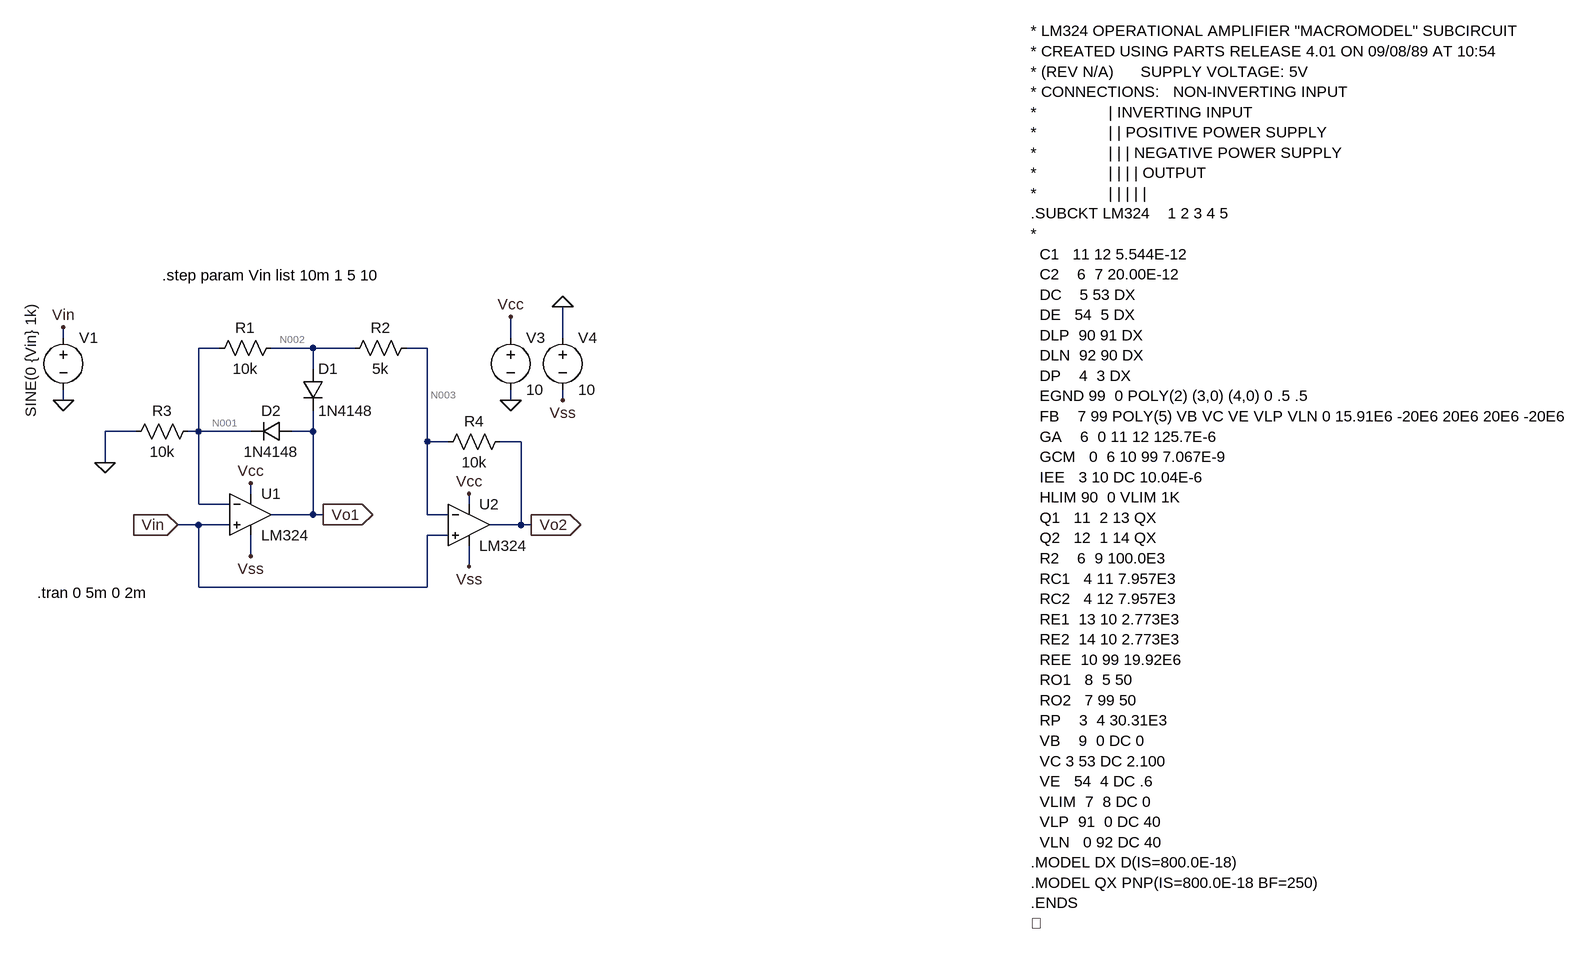
[diagram p0: schematic L1_C3.asc]
L1_C3.asc, the LTspice schematic file:
Version 4
SHEET 1 2516 10852
WIRE -144 -80 -144 -96
WIRE 544 -80 544 -112
WIRE 624 -80 624 -128
WIRE 96 -64 64 -64
WIRE 240 -64 176 -64
WIRE 304 -64 240 -64
WIRE 416 -64 384 -64
WIRE 240 -32 240 -64
WIRE -144 16 -144 0
WIRE 544 16 544 0
WIRE 624 16 624 0
WIRE -32 64 -80 64
WIRE 64 64 64 -64
WIRE 64 64 48 64
WIRE 144 64 64 64
WIRE 240 64 240 32
WIRE 240 64 208 64
WIRE 416 80 416 -64
WIRE 448 80 416 80
WIRE 560 80 528 80
WIRE -80 112 -80 64
WIRE 144 160 144 144
WIRE 64 176 64 64
WIRE 112 176 64 176
WIRE 480 176 480 160
WIRE 240 192 240 64
WIRE 240 192 176 192
WIRE 256 192 240 192
WIRE 416 192 416 80
WIRE 448 192 416 192
WIRE 64 208 32 208
WIRE 112 208 64 208
WIRE 560 208 560 80
WIRE 560 208 512 208
WIRE 576 208 560 208
WIRE 448 224 416 224
WIRE 144 256 144 224
WIRE 480 272 480 240
WIRE 64 304 64 208
WIRE 416 304 416 224
WIRE 416 304 64 304
FLAG -144 16 0
FLAG 544 16 0
FLAG 32 208 Vin
IOPIN 32 208 In
FLAG -144 -96 Vin
FLAG 624 -128 0
FLAG 544 -112 Vcc
FLAG 144 144 Vcc
FLAG 480 160 Vcc
FLAG 624 16 Vss
FLAG 480 272 Vss
FLAG 144 256 Vss
FLAG 576 208 Vo2
IOPIN 576 208 Out
FLAG -80 112 0
FLAG 256 192 Vo1
IOPIN 256 192 Out
SYMBOL res 192 -80 R90
WINDOW 0 0 56 VBottom 2
WINDOW 3 32 56 VTop 2
SYMATTR InstName R1
SYMATTR Value 10k
SYMBOL res 400 -80 R90
WINDOW 0 0 56 VBottom 2
WINDOW 3 32 56 VTop 2
SYMATTR InstName R2
SYMATTR Value 5k
SYMBOL res 64 48 R90
WINDOW 0 0 56 VBottom 2
WINDOW 3 32 56 VTop 2
SYMATTR InstName R3
SYMATTR Value 10k
SYMBOL res 544 64 R90
WINDOW 0 0 56 VBottom 2
WINDOW 3 32 56 VTop 2
SYMATTR InstName R4
SYMATTR Value 10k
SYMBOL voltage -144 -96 R0
WINDOW 123 0 0 Left 0
WINDOW 39 0 0 Left 0
WINDOW 3 -50 -37 VRight 2
SYMATTR Value SINE(0 {Vin} 1k)
SYMATTR InstName V1
SYMBOL voltage 544 -96 R0
WINDOW 123 0 0 Left 0
WINDOW 39 0 0 Left 0
SYMATTR InstName V3
SYMATTR Value 10
SYMBOL voltage 624 -96 R0
WINDOW 123 0 0 Left 0
WINDOW 39 0 0 Left 0
SYMATTR InstName V4
SYMATTR Value 10
SYMBOL diode 208 48 R90
WINDOW 0 0 32 VBottom 2
WINDOW 3 32 32 VTop 2
SYMATTR InstName D2
SYMATTR Value 1N4148
SYMBOL diode 224 -32 R0
SYMATTR InstName D1
SYMATTR Value 1N4148
SYMBOL OpAmps\\opamp2 144 128 R0
SYMATTR InstName U1
SYMATTR Value LM324
SYMBOL OpAmps\\opamp2 480 144 R0
SYMATTR InstName U2
SYMATTR Value LM324
TEXT -184 312 Left 2 !.tran 0 5m 0 2m
TEXT 8 -176 Left 2 !.step param Vin list 10m 1 5 10
TEXT 1344 -552 Left 2 !* LM324 OPERATIONAL AMPLIFIER "MACROMODEL" SUBCIRCUIT\n* CREATED USING PARTS RELEASE 4.01 ON 09/08/89 AT 10:54\n* (REV N/A)      SUPPLY VOLTAGE: 5V\n* CONNECTIONS:   NON-INVERTING INPUT\n*                | INVERTING INPUT\n*                | | POSITIVE POWER SUPPLY\n*                | | | NEGATIVE POWER SUPPLY\n*                | | | | OUTPUT\n*                | | | | |\n.SUBCKT LM324    1 2 3 4 5\n*\n  C1   11 12 5.544E-12\n  C2    6  7 20.00E-12\n  DC    5 53 DX\n  DE   54  5 DX\n  DLP  90 91 DX\n  DLN  92 90 DX\n  DP    4  3 DX\n  EGND 99  0 POLY(2) (3,0) (4,0) 0 .5 .5\n  FB    7 99 POLY(5) VB VC VE VLP VLN 0 15.91E6 -20E6 20E6 20E6 -20E6\n  GA    6  0 11 12 125.7E-6\n  GCM   0  6 10 99 7.067E-9\n  IEE   3 10 DC 10.04E-6\n  HLIM 90  0 VLIM 1K\n  Q1   11  2 13 QX\n  Q2   12  1 14 QX\n  R2    6  9 100.0E3\n  RC1   4 11 7.957E3\n  RC2   4 12 7.957E3\n  RE1  13 10 2.773E3\n  RE2  14 10 2.773E3\n  REE  10 99 19.92E6\n  RO1   8  5 50\n  RO2   7 99 50\n  RP    3  4 30.31E3\n  VB    9  0 DC 0\n  VC 3 53 DC 2.100\n  VE   54  4 DC .6\n  VLIM  7  8 DC 0\n  VLP  91  0 DC 40\n  VLN   0 92 DC 40\n.MODEL DX D(IS=800.0E-18)\n.MODEL QX PNP(IS=800.0E-18 BF=250)\n.ENDS\n

The netlist it stands for:
* L1_C3.asc
R1 N002 N001 10k
R2 N003 N002 5k
R3 N001 0 10k
R4 Vo2 N003 10k
V1 Vin 0 SINE(0 {Vin} 1k)
V3 Vcc 0 10
V4 0 Vss 10
D2 Vo1 N001 1N4148
D1 N002 Vo1 1N4148
XU1 Vin N001 Vcc Vss Vo1 LM324  ; pins In+ In- V+ V- OUT
XU2 Vin N003 Vcc Vss Vo2 LM324  ; pins In+ In- V+ V- OUT
.model D D
.lib standard.dio
.tran 0 5m 0 2m
.step param Vin list 10m 1 5 10
* LM324 OPERATIONAL AMPLIFIER "MACROMODEL" SUBCIRCUIT
* CREATED USING PARTS RELEASE 4.01 ON 09/08/89 AT 10:54
* (REV N/A)      SUPPLY VOLTAGE: 5V
* CONNECTIONS:   NON-INVERTING INPUT
*                | INVERTING INPUT
*                | | POSITIVE POWER SUPPLY
*                | | | NEGATIVE POWER SUPPLY
*                | | | | OUTPUT
*                | | | | |
.SUBCKT LM324    1 2 3 4 5
*
  C1   11 12 5.544E-12
  C2    6  7 20.00E-12
  DC    5 53 DX
  DE   54  5 DX
  DLP  90 91 DX
  DLN  92 90 DX
  DP    4  3 DX
  EGND 99  0 POLY(2) (3,0) (4,0) 0 .5 .5
  FB    7 99 POLY(5) VB VC VE VLP VLN 0 15.91E6 -20E6 20E6 20E6 -20E6
  GA    6  0 11 12 125.7E-6
  GCM   0  6 10 99 7.067E-9
  IEE   3 10 DC 10.04E-6
  HLIM 90  0 VLIM 1K
  Q1   11  2 13 QX
  Q2   12  1 14 QX
  R2    6  9 100.0E3
  RC1   4 11 7.957E3
  RC2   4 12 7.957E3
  RE1  13 10 2.773E3
  RE2  14 10 2.773E3
  REE  10 99 19.92E6
  RO1   8  5 50
  RO2   7 99 50
  RP    3  4 30.31E3
  VB    9  0 DC 0
  VC 3 53 DC 2.100
  VE   54  4 DC .6
  VLIM  7  8 DC 0
  VLP  91  0 DC 40
  VLN   0 92 DC 40
.MODEL DX D(IS=800.0E-18)
.MODEL QX PNP(IS=800.0E-18 BF=250)
.ENDS

.backanno
.end

* Results of the author's LTspice run, read from the files saved beside the schematic
* Operating Point (first step), zero values left out:
*   vin = 10 m
*   V(n002) = -239.5 µV
*   V(n001) = -32.18 µV
*   V(n003) = -33.66 µV
*   V(vo2) = 178.7 µV
*   V(vcc) = 10 V
*   V(vss) = -10 V
*   V(vo1) = -147.1 mV
*   I(D2) = -2.422 nA
*   I(D1) = 61.91 nA
*   I(R1) = -20.73 nA
*   I(R2) = 41.17 nA
*   I(R3) = -3.218 nA
*   I(R4) = 21.23 nA
*   I(V1) = 39.85 nA
*   I(V3) = -1.34 mA
*   I(V4) = -1.34 mA
*   Ix(u1:1) = -19.92 nA
*   Ix(u1:2) = -19.94 nA
*   Ix(u1:3) = 669.9 µA
*   Ix(u1:4) = -669.8 µA
*   Ix(u1:5) = 64.33 nA
*   Ix(u2:1) = -19.92 nA
*   Ix(u2:2) = -19.94 nA
*   Ix(u2:3) = 669.9 µA
*   Ix(u2:4) = -669.8 µA
*   Ix(u2:5) = -21.23 nA
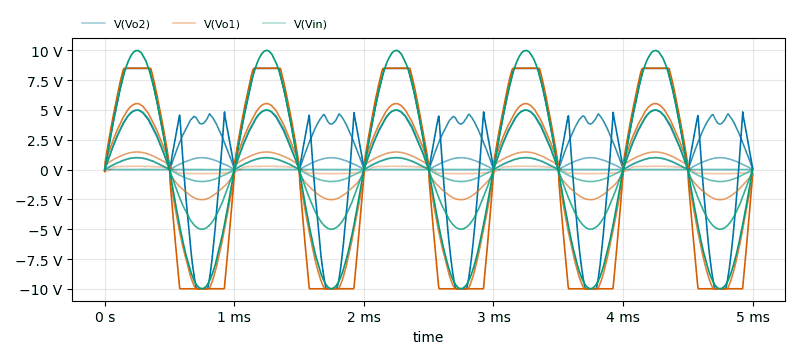
[diagram p1: Transient Analysis of L1_C3.asc, plotted from the saved traces]
* Transient Analysis, 4 runs:
*   V(Vo2) [vin=0.01]: min -3.099 mV, max 10.13 mV, average 6.057 mV, rms 6.996 mV, last 1.729 mV
*   V(Vo2) [vin=1]: min -50.27 mV, max 996.8 mV, average 621.9 mV, rms 698.1 mV, last 17.89 mV
*   V(Vo2) [vin=5]: min -131.6 mV, max 4.985 V, average 3.045 V, rms 3.395 V, last 64.75 mV
*   V(Vo2) [vin=10]: min -9.996 V, max 8.494 V, average 1.525 V, rms 6.373 V, last 125.1 mV
*   V(Vo1) [vin=0.01]: min -341.9 mV, max 279.9 mV, average -33.61 mV, rms 268 mV, last -212.8 mV
*   V(Vo1) [vin=1]: min -2.522 V, max 1.477 V, average -335.9 mV, rms 1.539 V, last -315 mV
*   V(Vo1) [vin=5]: min -9.996 V, max 5.538 V, average -1.572 V, rms 5.977 V, last -388.3 mV
*   V(Vo1) [vin=10]: min -9.996 V, max 8.494 V, average -1.111 V, rms 7.971 V, last -440 mV
*   V(Vin) [vin=0.01]: min -9.999 mV, max 10 mV, average 317.8 nV, rms 7.099 mV, last 0 V
*   V(Vin) [vin=1]: min -999.6 mV, max 999.8 mV, average 5.042 µV, rms 708.6 mV, last 0 V
*   V(Vin) [vin=5]: min -5 V, max 5 V, average -4.719 mV, rms 3.543 V, last 0 V
*   V(Vin) [vin=10]: min -9.997 V, max 10 V, average -1.987 mV, rms 7.073 V, last 0 V